# Altium project PCB_Project.PrjPcb
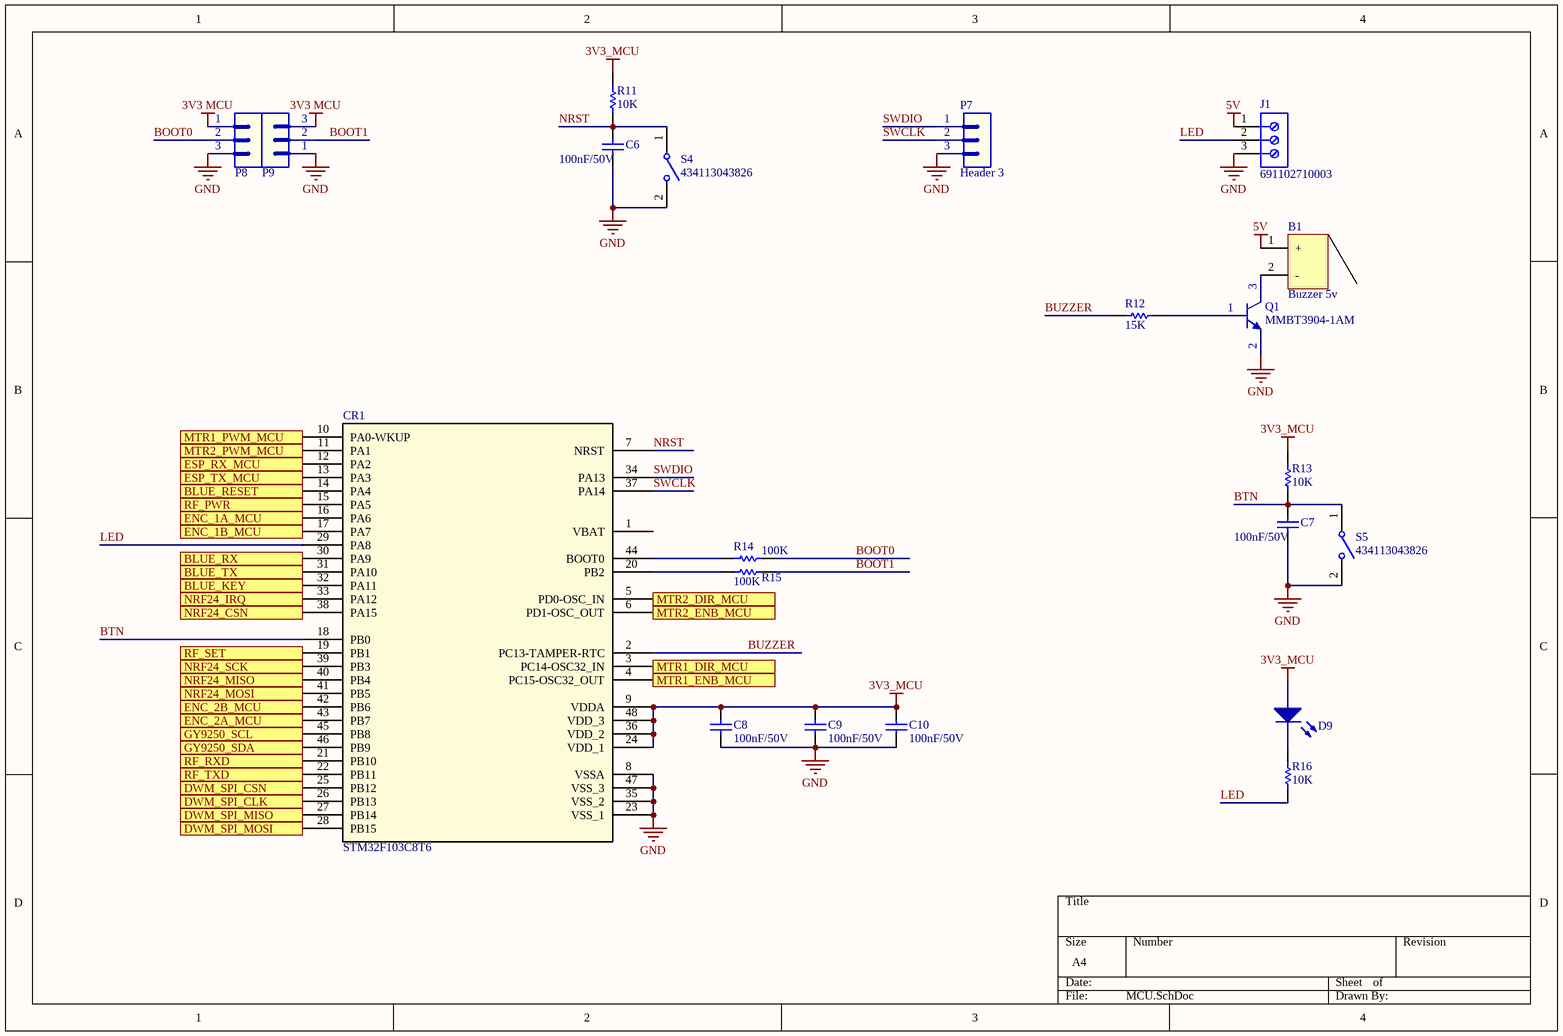
[diagram p0: MCU.SchDoc]
3 sheets, 59 parts. Net scope: flat (ports and power ports of the same name join across sheets).
Board file: PCB1.PcbDoc
Sheets:
  MCU.SchDoc
  Motor Control.SchDoc
  RF.SchDoc

## Sheet MCU.SchDoc
size A4

### Parts
B1  Buzzer 5v  [Buzzer 5v]
C6  value 100nF/50V  [CAP-SM-0805]  (hidden comment: Cap-1nF-50V-0805)
C7  value 100nF/50V  [CAP-SM-0805]  (hidden comment: Cap-1nF-50V-0805)
C8  value 100nF/50V  [CAP-SM-0805]  (hidden comment: Cap-1nF-50V-0805)
C9  value 100nF/50V  [CAP-SM-0805]  (hidden comment: Cap-1nF-50V-0805)
C10  value 100nF/50V  [CAP-SM-0805]  (hidden comment: Cap-1nF-50V-0805)
CR1  STM32F103C8T6  [STM32F103C8T6]
D9  LED  [LED_0603_Blue]  (value not drawn)
J1  691102710003  [691102710003]
P7  Header 3  [jp3]
P8  (no value)  [jp3]
P9  (no value)  [jp3]
Q1  MMBT3904-1AM  [SOT23_NEX]
R11  value 10K  [RES-SM-0805]  (hidden comment: Res-0-0805)
R12  value 15K  [RES-SM-0805]  (hidden comment: Res-12K-0805)
R13  value 10K  [RES-SM-0805]  (hidden comment: Res-0-0805)
R14  value 100K  [RES-SM-0805]  (hidden comment: Res-1K-0805)
R15  value 100K  [RES-SM-0805]  (hidden comment: Res-1K-0805)
R16  value 10K  [RES-SM-0805]  (hidden comment: Res-0-0805)
S4  434113043826  [434113043826]
S5  434113043826  [434113043826]

### Ports
BLUE_KEY (out), BLUE_RESET (out), BLUE_RX (out), BLUE_TX (in), DWM_SPI_CLK (out), DWM_SPI_CSN (out), DWM_SPI_MISO (in), DWM_SPI_MOSI (out), ENC_1A_MCU (in), ENC_1B_MCU (in), ENC_2A_MCU (in), ENC_2B_MCU (in), ESP_RX_MCU (out), ESP_TX_MCU (in), GY9250_SCL (out), GY9250_SDA (out), MTR1_DIR_MCU (out), MTR1_ENB_MCU (out), MTR1_PWM_MCU (out), MTR2_DIR_MCU (out), MTR2_ENB_MCU (out), MTR2_PWM_MCU (out), NRF24_CSN (out), NRF24_IRQ (in), NRF24_MISO (in), NRF24_MOSI (out), NRF24_SCK (out), RF_PWR (out), RF_RXD (out), RF_SET (out), RF_TXD (in)

### Nets
3V3 MCU: P8.1 P9.3
3V3_MCU: C8.2 C9.2 C10.2 CR1.9(VDDA) CR1.24(VDD_1) CR1.36(VDD_2) CR1.48(VDD_3) D9.1(A) R11.2 R13.2
5V: B1.1(+) J1.1
GND: C6.1 C7.1 C8.1 C9.1 C10.1 CR1.8(VSSA) CR1.23(VSS_1) CR1.35(VSS_2) CR1.47(VSS_3) J1.3 P7.3 P8.3 P9.1 Q1.2(E) S4.2 S5.2
BOOT0: P8.2 R14.2
BOOT1: P9.2 R15.2
BTN: C7.2 CR1.18(PB0) R13.1 S5.1
BUZZER: CR1.2(PC13-TAMPER-RTC) R12.1
LED: CR1.29(PA8) J1.2 R16.1
NRST: C6.2 CR1.7(NRST) R11.1 S4.1
RF_RXD: CR1.21(PB10) ; port RF_RXD
RF_SET: CR1.19(PB1) ; port RF_SET
RF_TXD: CR1.22(PB11) ; port RF_TXD
SWCLK: CR1.37(PA14) P7.2
SWDIO: CR1.34(PA13) P7.1
NetB1_2: B1.2(-) Q1.3(C)
NetCR1_3: CR1.3(PC14-OSC32_IN) ; port MTR1_DIR_MCU
NetCR1_4: CR1.4(PC15-OSC32_OUT) ; port MTR1_ENB_MCU
NetCR1_5: CR1.5(PD0-OSC_IN) ; port MTR2_DIR_MCU
NetCR1_6: CR1.6(PD1-OSC_OUT) ; port MTR2_ENB_MCU
NetCR1_10: CR1.10(PA0-WKUP) ; port MTR1_PWM_MCU
NetCR1_11: CR1.11(PA1) ; port MTR2_PWM_MCU
NetCR1_12: CR1.12(PA2) ; port ESP_RX_MCU
NetCR1_13: CR1.13(PA3) ; port ESP_TX_MCU
NetCR1_14: CR1.14(PA4) ; port BLUE_RESET
NetCR1_15: CR1.15(PA5) ; port RF_PWR
NetCR1_16: CR1.16(PA6) ; port ENC_1A_MCU
NetCR1_17: CR1.17(PA7) ; port ENC_1B_MCU
NetCR1_20: CR1.20(PB2) R15.1
NetCR1_25: CR1.25(PB12) ; port DWM_SPI_CSN
NetCR1_26: CR1.26(PB13) ; port DWM_SPI_CLK
NetCR1_27: CR1.27(PB14) ; port DWM_SPI_MISO
NetCR1_28: CR1.28(PB15) ; port DWM_SPI_MOSI
NetCR1_30: CR1.30(PA9) ; port BLUE_RX
NetCR1_31: CR1.31(PA10) ; port BLUE_TX
NetCR1_32: CR1.32(PA11) ; port BLUE_KEY
NetCR1_33: CR1.33(PA12) ; port NRF24_IRQ
NetCR1_38: CR1.38(PA15) ; port NRF24_CSN
NetCR1_39: CR1.39(PB3) ; port NRF24_SCK
NetCR1_40: CR1.40(PB4) ; port NRF24_MISO
NetCR1_41: CR1.41(PB5) ; port NRF24_MOSI
NetCR1_42: CR1.42(PB6) ; port ENC_2B_MCU
NetCR1_43: CR1.43(PB7) ; port ENC_2A_MCU
NetCR1_44: CR1.44(BOOT0) R14.1
NetCR1_45: CR1.45(PB8) ; port GY9250_SCL
NetCR1_46: CR1.46(PB9) ; port GY9250_SDA
NetD9_2: D9.2(K) R16.2
NetQ1_1: Q1.1(B) R12.2

Not connected (* = marked no-connect by the designer): CR1 1(VBAT)

### Library data of the parts
C6-C10 = Cap-1nF-50V-0805: CAP CER 1000PF 100V X7R 0805; Manufacturer: Johanson Dielectrics Inc.; Manufacturer Part Number: 101X15W102MV4E; Local Supplier: thegioiic; Local Supplier Link: https://thegioiic.com/products/tu-1nf-50v-0805; Supplier 1: Digikey; Supplier 1 Link: https://www.digikey.com/product-detail/en/johanson-dielectrics-inc/101X15W102MV4E/709-1335-1-ND/2327235; Supplier 1 Part Number: 709-1335-1-ND
CR1 = STM32F103C8T6: SourceLibrary: StMicro_2011-06-07; Built_By: EMA_UL_Team; Vendor: STMicroelectronics; Type: DEV; Manufacturer_Part_Number: STM32F103C8T6; Copyright: Copyright (C) 2018 Accelerated Designs. All rights reserved; RefDes: RefDes
J1 = 691102710003: WR-TBL Serie 102 Horizontal Entry Modular, Pressure Clamp, pitch 5mm, 3p; Compliance: Lead free / RoHS; Modularity: Yes; PCB/Cable/Panel: PCB; Pin Number: 3; Rated Current [UL]: 15A; Working Voltage [UL]: 250VAC; ComponentLink1Description: Manufacturer; ComponentLink1URL: http://www.we-online.de; ComponentLink2URL: https://katalog.we-online.de/em/datasheet/691102710003.pdf; ComponentLink2Description: Datasheet; Mounting Technology: THT; Part Number: 691102710003; Packaging: Box; Operating Temperature: -40 to +105degC; Pitch: 5mm; Published Date: October 2019; Type: Horizontal; Publisher: Wurth Elektronik; Application: Pressure Clamp
P7-P9 = Header 3: Header, 3-Pin; LatestRevisionDate: 17-Jul-2002; LatestRevisionNote: Re-released for DXP Platform.; Publisher: Altium Limited
R11 R13 R16 = Res-0-0805: RES 0 OHM JUMPER 0805; Manufacturer: Vishay Dale; Manufacturer Part Number: WSL080500000ZEA9; Local Supplier: thegioiic; Local Supplier Link: https://thegioiic.com/products/dien-tro-0-ohm-0805-5; Supplier 1: Digikey; Supplier 1 Link: https://www.digikey.com/product-detail/en/vishay-dale/WSL080500000ZEA9/541-3928-1-ND/7423223; Supplier 1 Part Number: 541-3928-1-ND
R12 = Res-12K-0805: RES 12 KOHM JUMPER 0805; Manufacturer: Vishay Thin Film; Manufacturer Part Number: PAT0805E3121BST1; Local Supplier: icdayroi; Local Supplier Link: https://icdayroi.com/dien-tro-12k-0805-1-goi-50-con; Supplier 1: Digikey; Supplier 1 Link: https://www.digikey.com/product-detail/en/vishay-thin-film/PAT0805E3121BST1/PAT0805E3121BST1-ND/2281536; Supplier 1 Part Number: PAT0805E3121BST1-ND
R14 R15 = Res-1K-0805: RES 1K OHM 1% 1/4W 0805; Manufacturer: Stackpole Electronics Inc; Manufacturer Part Number: RNCP0805FTD1K00; Local Supplier: thegioiic; Local Supplier Link: https://thegioiic.com/products/dien-tro-1k-ohm-0805-5; Supplier 1: Digikey; Supplier 1 Link: https://www.digikey.com/product-detail/en/stackpole-electronics-inc/RNCP0805FTD1K00/RNCP0805FTD1K00CT-ND/2240568; Supplier 1 Part Number: RNCP0805FTD1K00CT-ND
S4 S5 = 434113043826: WS-TASV J-Bend SMT Tact Switch 6x3.5mm, height 4.3mm, 260gf; Rated Voltage: 12VDC; Rated Current: 50mA; Washable: No; ComponentLink1Description: Manufacturer; ComponentLink1URL: http://www.we-online.de; ComponentLink2Description: Datasheet; ComponentLink2URL: https://katalog.we-online.com/em/datasheet/434113043826.pdf; Operating Temperature: -40 to +85degC; Part Number: 434113043826; Published Date: September 2019; Contact Material: Stainless Steel; Height: 4.3mm; Mounting Technology: SMT; Contact Plating: Silver; Operation Force: 260gf; Packaging: Tape and Reel; Terminal Material: Copper Alloy; Publisher: Wurth Elektronik; Terminal Plating: Silver

## Sheet Motor Control.SchDoc
size A4
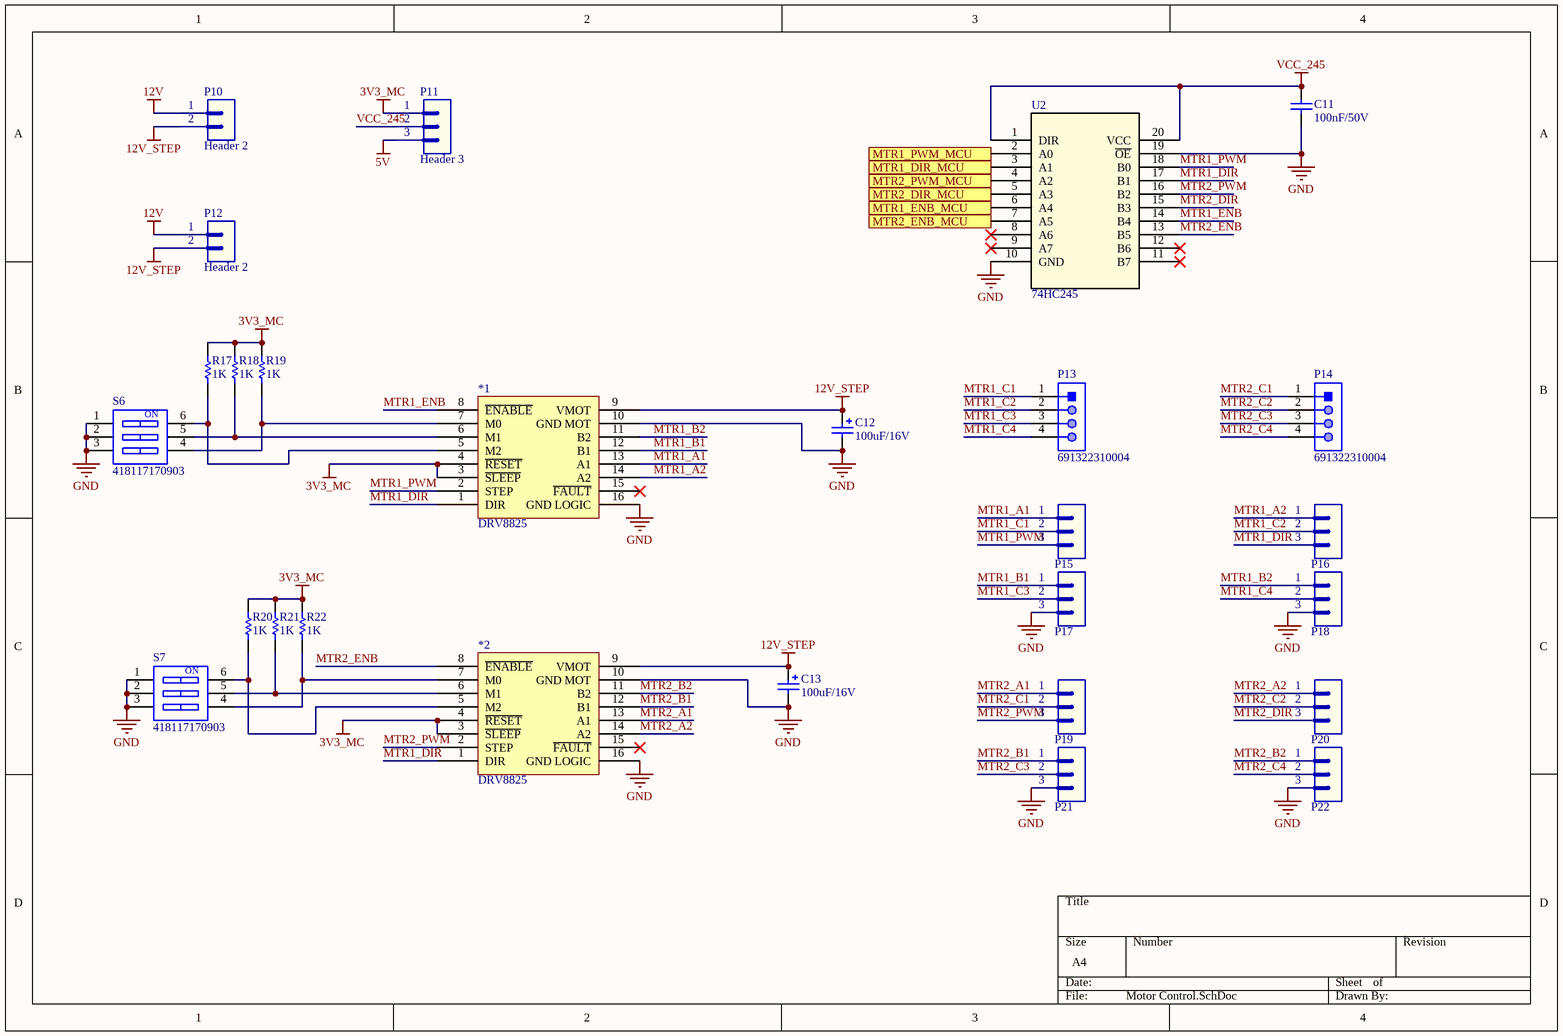
[diagram p1: Motor Control.SchDoc]

### Parts
*1  DRV8825  [DRV8825]
*2  DRV8825  [DRV8825]
C11  value 100nF/50V  [CAP-SM-0805]  (hidden comment: Cap-10uF-50V-0805)
C12  value 100uF/16V  [CAP-SM-AL-SIZE-D-D6L6]  (hidden comment: Cap-Al-100uF-16V-D6L5)
C13  value 100uF/16V  [CAP-SM-AL-SIZE-D-D6L6]  (hidden comment: Cap-Al-220uF-35V-D8L10)
P10  Header 2  [JP2]
P11  Header 3  [JP3]
P12  Header 2  [JP2]
P13  691322310004  [691322310004]
P14  691322310004  [691322310004]
P15  Header 3  [JP3]  (value not drawn)
P16  Header 3  [JP3]  (value not drawn)
P17  Header 3  [JP3]  (value not drawn)
P18  Header 3  [JP3]  (value not drawn)
P19  Header 3  [JP3]  (value not drawn)
P20  Header 3  [JP3]  (value not drawn)
P21  Header 3  [JP3]  (value not drawn)
P22  Header 3  [JP3]  (value not drawn)
R17  value 1K  [RES-SM-0805]  (hidden comment: Res-1K-0805)
R18  value 1K  [RES-SM-0805]  (hidden comment: Res-1K-0805)
R19  value 1K  [RES-SM-0805]  (hidden comment: Res-1K-0805)
R20  value 1K  [RES-SM-0805]  (hidden comment: Res-1K-0805)
R21  value 1K  [RES-SM-0805]  (hidden comment: Res-1K-0805)
R22  value 1K  [RES-SM-0805]  (hidden comment: Res-1K-0805)
S6  418117170903  [418117170903]
S7  418117170903  [418117170903]
U2  74HC245  [74HC245,625]

### Ports
MTR1_DIR_MCU (in), MTR1_ENB_MCU (in), MTR1_PWM_MCU (in), MTR2_DIR_MCU (in), MTR2_ENB_MCU (in), MTR2_PWM_MCU (in)

### Nets
3V3_MC: *1.3(~{SLEEP}) *1.4(~{RESET}) *2.3(~{SLEEP}) *2.4(~{RESET}) P11.1 R17.2 R18.2 R19.2 R20.2 R21.2 R22.2
5V: P11.3
12V: P10.1 P12.1
12V_STEP: *1.9(VMOT) *2.9(VMOT) C12.1 C13.2 P10.2 P12.2
GND: *1.10(GND_MOT) *1.16(GND_LOGIC) *2.10(GND_MOT) *2.16(GND_LOGIC) C11.1 C12.2 C13.1 P17.3 P18.3 P21.3 P22.3 S6.1 S6.2 S6.3 S7.1 S7.2 S7.3 U2.10(GND) U2.19(~{OE})
VCC_245: C11.2 P11.2 U2.1(DIR) U2.20(VCC)
MTR1_A1: *1.13(A1) P15.1
MTR1_A2: *1.14(A2) P16.1
MTR1_B1: *1.12(B1) P17.1
MTR1_B2: *1.11(B2) P18.1
MTR1_C1: P13.1 P15.2
MTR1_C2: P13.2 P16.2
MTR1_C3: P13.3 P17.2
MTR1_C4: P13.4 P18.2
MTR1_DIR: *1.1(DIR) *2.1(DIR) P16.3 U2.17(B1)
MTR1_ENB: *1.8(~{ENABLE}) U2.14(B4)
MTR1_PWM: *1.2(STEP) P15.3 U2.18(B0)
MTR2_A1: *2.13(A1) P19.1
MTR2_A2: *2.14(A2) P20.1
MTR2_B1: *2.12(B1) P21.1
MTR2_B2: *2.11(B2) P22.1
MTR2_C1: P14.1 P19.2
MTR2_C2: P14.2 P20.2
MTR2_C3: P14.3 P21.2
MTR2_C4: P14.4 P22.2
MTR2_DIR: P20.3 U2.15(B3)
MTR2_ENB: *2.8(~{ENABLE}) U2.13(B5)
MTR2_PWM: *2.2(STEP) P19.3 U2.16(B2)
Net*1_5: *1.5(M2) R17.1 S6.6
Net*1_6: *1.6(M1) R18.1 S6.5
Net*1_7: *1.7(M0) R19.1 S6.4
Net*2_5: *2.5(M2) R20.1 S7.6
Net*2_6: *2.6(M1) R21.1 S7.5
Net*2_7: *2.7(M0) R22.1 S7.4
NetCR1_3: U2.3(A1) ; port MTR1_DIR_MCU
NetCR1_4: U2.6(A4) ; port MTR1_ENB_MCU
NetCR1_5: U2.5(A3) ; port MTR2_DIR_MCU
NetCR1_6: U2.7(A5) ; port MTR2_ENB_MCU
NetCR1_10: U2.2(A0) ; port MTR1_PWM_MCU
NetCR1_11: U2.4(A2) ; port MTR2_PWM_MCU

Not connected (* = marked no-connect by the designer): *1 15(~{FAULT})*; *2 15(~{FAULT})*; U2 8(A6)* 9(A7)* 11(B7)* 12(B6)*

### Notes on the sheet
- (in symbol 418117170903) ON

### Library data of the parts
C11 = Cap-10uF-50V-0805: CAP CER 10UF 50V X5R 0805; Manufacturer: Yageo; Manufacturer Part Number: CC0805KKX5R9BB106; Local Supplier: thegioiic; Local Supplier Link: https://thegioiic.com/products/tu-10uf-50v-0805; Supplier 1: Digikey; Supplier 1 Link: https://www.digikey.com/product-detail/en/yageo/CC0805KKX5R9BB106/311-3499-2-ND/7164383; Supplier 1 Part Number: 311-3499-2-ND
C12 C13 = Cap-Al-100uF-16V-D6L5: CAP ALUM 100UF 20% 16V SMD; Manufacturer: Nichicon; Manufacturer Part Number: UWX1C101MCL1GB; Local Supplier: thegioiic; Local Supplier Link: https://thegioiic.com/products/tu-nhom-smd-100uf-16v-d6-3l5-4; Supplier 1: Digikey; Supplier 1 Part Number: 493-2105-1-ND; Supplier 1 Link: https://www.digikey.com/product-detail/en/nichicon/UWX1C101MCL1GB/493-2105-1-ND/590080
P10 P12 = Header 2: Header, 2-Pin; LatestRevisionDate: 17-Jul-2002; LatestRevisionNote: Re-released for DXP Platform.; Publisher: Altium Limited
P11 P15-P22 = Header 3: Header, 3-Pin; LatestRevisionDate: 17-Jul-2002; LatestRevisionNote: Re-released for DXP Platform.; Publisher: Altium Limited
P13 P14 = 691322310004: WR-TBL Serie 322 Horizontal PCB Header, Pluggable, pitch 3.81mm, 4p; Compliance: RoHS; Modularity: No; Pin Number: 4; Rated Current [UL]: 10A; Working Voltage [UL]: 300VAC; ComponentLink1Description: Manufacturer; ComponentLink1URL: http://www.we-online.de; ComponentLink2URL: https://katalog.we-online.de/em/datasheet/691322310004.pdf; ComponentLink2Description: Datasheet; Mounting Technology: THT; Part Number: 691322310004; Packaging: Box; Operating Temperature: -40 to +105degC; PCB/Cable/Panel: PCB; Pitch: 3.81mm; Published Date: October 2019; Type: Horizontal; Publisher: Wurth Elektronik; Application: Pluggable
R17-R22 = Res-1K-0805: as R14 on sheet MCU; Local Supplier: thegioiic; Local Supplier Link: https://thegioiic.com/products/dien-tro-1k-ohm-0805-5; Supplier 1: Digikey; Supplier 1 Link: https://www.digikey.com/product-detail/en/stackpole-electronics-inc/RNCP0805FTD1K00/RNCP0805FTD1K00CT-ND/2240568; Supplier 1 Part Number: RNCP0805FTD1K00CT-ND
S6 S7 = 418117170903: WS-DITV Compact THT Dip Switch, Flat Actuator, pitch 2.54mm, 3p; Operation Force: 800g; Pole Number: 3; Actuator Type: Flat Type; Circuit: SPST-NO; Rated Current Switching: 25mA; Rated Current Non-Switching: 100mA; Rated Voltage Non-Switching: 50VDC; Rated Voltage Switching: 24VDC; ComponentLink1Description: Manufacturer; ComponentLink1URL: http://www.we-online.de; ComponentLink2Description: Datasheet; ComponentLink2URL: https://katalog.we-online.com/em/datasheet/418117170903.pdf; Pitch: 2.54mm; Contact Material: Copper Alloy; Mounting Technology: THT; Operating Temperature: -40 to +85degC; Contact Plating: Gold; Packaging: Tube; Part Number: 418117170903; Publisher: Wurth Elektronik; Published Date: September 2019
U2 = 74HC245: No Description Available; Vendor: Texas Instruments; Built_By: EMA_UL_Team; SourceLibrary: TI_2002-01-01_7; Manufacturer_Part_Number: 74HC245; Copyright: Copyright (C) 2018 Accelerated Designs. All rights reserved; RefDes: RefDes; Type: DEV

## Sheet RF.SchDoc
size A
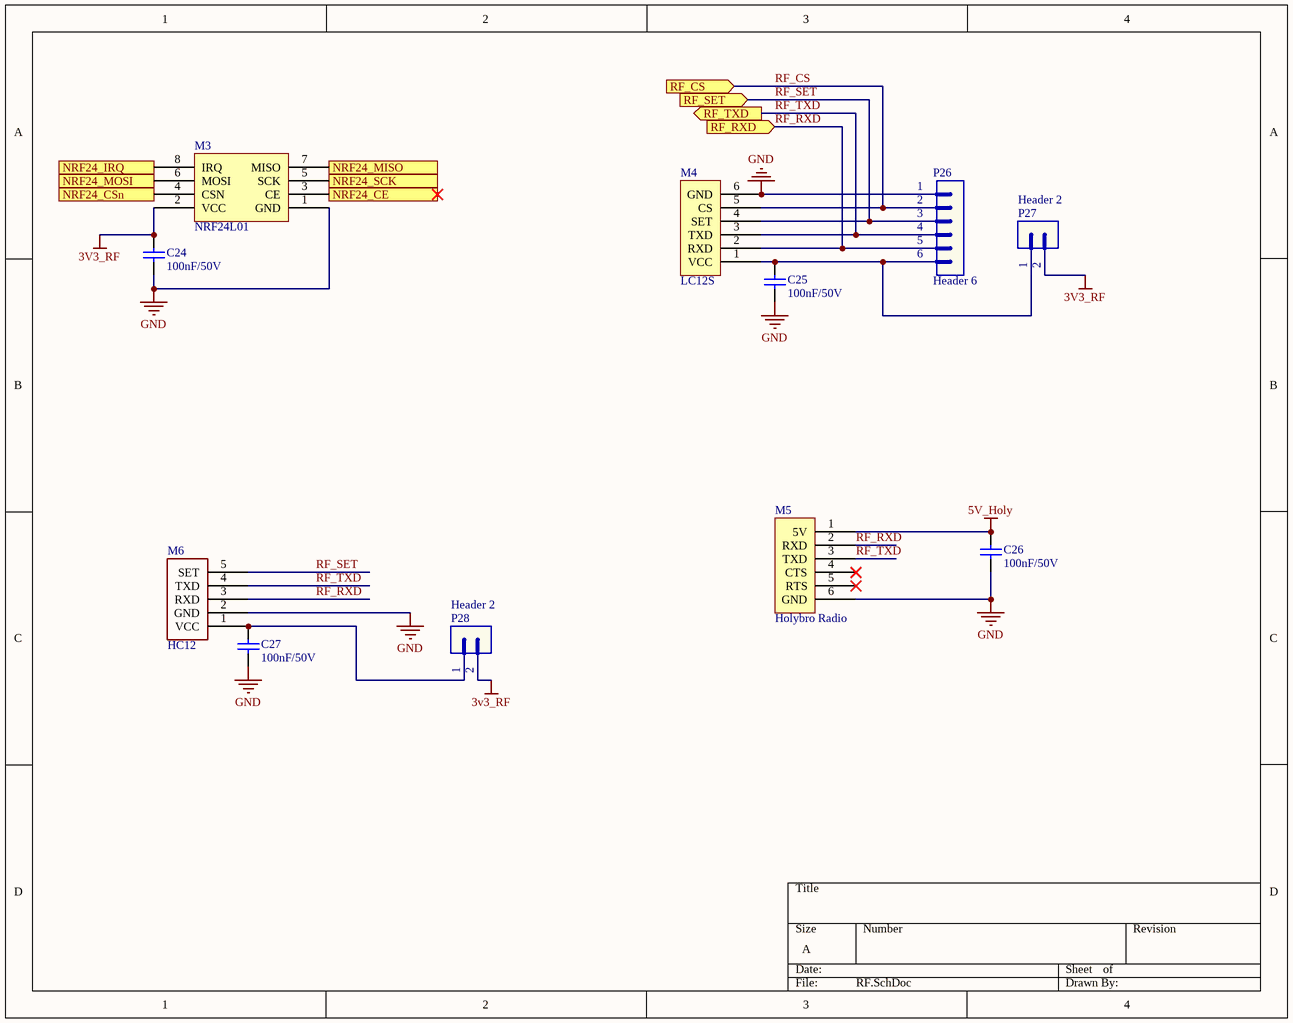
[diagram p2: RF.SchDoc]

### Parts
C24  value 100nF/50V  [CAP-SM-0805]  (hidden comment: Cap-1nF-50V-0805)
C25  value 100nF/50V  [CAP-SM-0805]  (hidden comment: Cap-1nF-50V-0805)
C26  value 100nF/50V  [CAP-SM-0805]  (hidden comment: Cap-1nF-50V-0805)
C27  value 100nF/50V  [CAP-SM-0805]  (hidden comment: Cap-1nF-50V-0805)
M3  NRF24L01  [NRF24L01]
M4  LC12S  [LC12S]
M5  Holybro Radio  [Holybro]
M6  HC12  [HC12]
P26  Header 6  [JP6]
P27  Header 2  [JP2]
P28  Header 2  [JP2]

### Ports
NRF24_CE (in), NRF24_CSn (in), NRF24_IRQ (out), NRF24_MISO (out), NRF24_MOSI (in), NRF24_SCK (in), RF_CS (in), RF_RXD (in), RF_SET (in), RF_TXD (out)

### Nets
3V3_RF: C24.2 M3.2(VCC) P27.2 P28.2
5V_Holy: C26.2 M5.1(5V)
GND: C24.1 C25.1 C26.1 C27.1 M3.1(GND) M4.6(GND) M5.6(GND) M6.2(GND) P26.1
RF_CS: M4.5(CS) P26.2 ; port RF_CS
RF_RXD: M4.2(RXD) M5.2(RXD) M6.3(RXD) P26.5 ; port RF_RXD
RF_SET: M4.4(SET) M6.5(SET) P26.3 ; port RF_SET
RF_TXD: M4.3(TXD) M5.3(TXD) M6.4(TXD) P26.4 ; port RF_TXD
NetC25_2: C25.2 M4.1(VCC) P26.6 P27.1
NetC27_2: C27.2 M6.1(VCC) P28.1
NetCR1_33: M3.8(IRQ) ; port NRF24_IRQ
NetCR1_38: M3.4(CSN) ; port NRF24_CSn
NetCR1_39: M3.5(SCK) ; port NRF24_SCK
NetCR1_40: M3.7(MISO) ; port NRF24_MISO
NetCR1_41: M3.6(MOSI) ; port NRF24_MOSI
NetM3_3: M3.3(CE) ; port NRF24_CE

Not connected (* = marked no-connect by the designer): M5 4(CTS)* 5(RTS)*

### Library data of the parts
C24-C27 = Cap-1nF-50V-0805: as C6 on sheet MCU; Local Supplier: thegioiic; Local Supplier Link: https://thegioiic.com/products/tu-1nf-50v-0805; Supplier 1: Digikey; Supplier 1 Link: https://www.digikey.com/product-detail/en/johanson-dielectrics-inc/101X15W102MV4E/709-1335-1-ND/2327235; Supplier 1 Part Number: 709-1335-1-ND
M3 = NRF24L01: Local supply: Hshop; Local supply link: https://lastminuteengineers.com/nrf24l01-arduino-wireless-communication/
M4 = LC12S: Local supply: HShop; Local supply link: https://hshop.vn/products/mach-thu-phat-rf-uart-lc12s-2-4ghz
M5 = Holybro: Supplier: https://www.lazada.vn/products/ld-holybro-433mhz-915-mhz-500-mw-thu-phat-vo-tuyen-xa-bo-v3-cho-pixhawk-4-dieu-khien-chuyen-bay-i430804435-s768474304.html?spm=a2o4n.searchlist.list.4.25396b19yIS9XO&search=1
M6 = HC12: Local supply: Hshop; Local supply number: HS000897; Local supply link: https://hshop.vn/products/mach-thu-phat-rf-uart-si4463-433mhzkhoang-coch-1km
P26 = Header 6: Header, 6-Pin; LatestRevisionDate: 17-Jul-2002; LatestRevisionNote: Re-released for DXP Platform.; Publisher: Altium Limited
P27 P28 = Header 2: Header, 2-Pin; LatestRevisionDate: 17-Jul-2002; LatestRevisionNote: Re-released for DXP Platform.; Publisher: Altium Limited

## Nets that join several sheets
5V: MCU (B1.1 J1.1), Motor Control (P11.3)
GND: MCU (16 pins), Motor Control (19 pins), RF (9 pins)
NetCR1_3: MCU (CR1.3), Motor Control (U2.3)
NetCR1_4: MCU (CR1.4), Motor Control (U2.6)
NetCR1_5: MCU (CR1.5), Motor Control (U2.5)
NetCR1_6: MCU (CR1.6), Motor Control (U2.7)
NetCR1_10: MCU (CR1.10), Motor Control (U2.2)
NetCR1_11: MCU (CR1.11), Motor Control (U2.4)
NetCR1_33: MCU (CR1.33), RF (M3.8)
NetCR1_38: MCU (CR1.38), RF (M3.4)
NetCR1_39: MCU (CR1.39), RF (M3.5)
NetCR1_40: MCU (CR1.40), RF (M3.7)
NetCR1_41: MCU (CR1.41), RF (M3.6)
RF_RXD: MCU (CR1.21), RF (M4.2 M5.2 M6.3 P26.5)
RF_SET: MCU (CR1.19), RF (M4.4 M6.5 P26.3)
RF_TXD: MCU (CR1.22), RF (M4.3 M5.3 M6.4 P26.4)